# EAGLE design thermoshield (EAGLE 7.6.0)
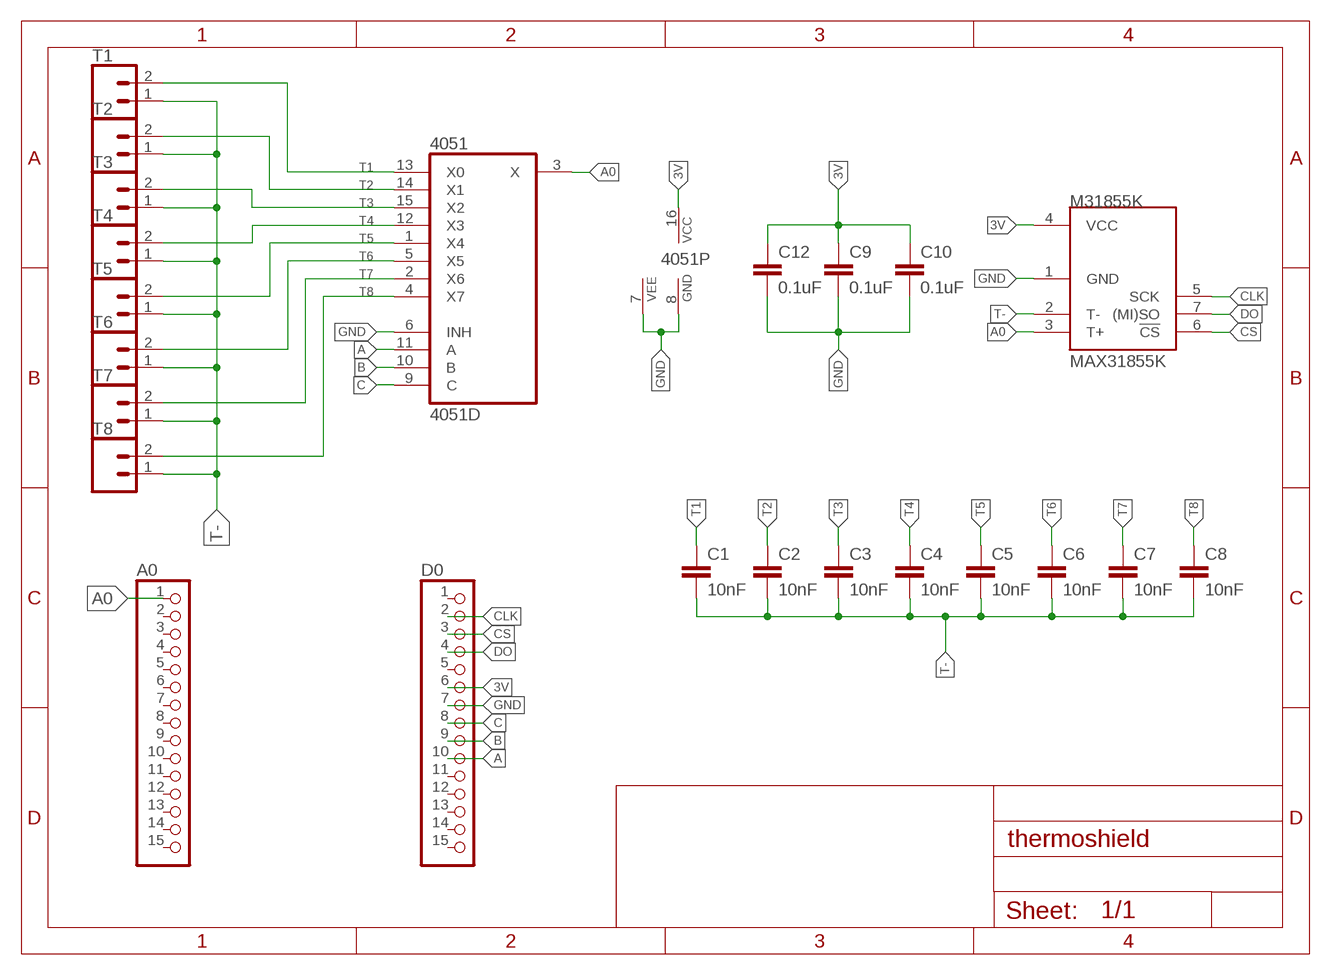
[diagram p0: schematic, sheet 1]

## Parts
4051  4051D  [SO16]
A0  PINHD-1X15  [1X15]
C1  10nF  10NF-0603-50V-10%  [0603]
C2  10nF  10NF-0603-50V-10%  [0603]
C3  10nF  10NF-0603-50V-10%  [0603]
C4  10nF  10NF-0603-50V-10%  [0603]
C5  10nF  10NF-0603-50V-10%  [0603]
C6  10nF  10NF-0603-50V-10%  [0603]
C7  10nF  10NF-0603-50V-10%  [0603]
C8  10nF  10NF-0603-50V-10%  [0603]
C9  0.1uF  0.1UF-0603-25V-(+80/-20%)  [0603]
C10  0.1uF  0.1UF-0603-25V-(+80/-20%)  [0603]
C12  0.1uF  0.1UF-0603-25V-(+80/-20%)  [0603]
D0  PINHD-1X15  [1X15]
M31855K  MAX31855K  [SO08]
T1  CONN_023.5MM-NO_SILK  [SCREWTERMINAL-3.5MM-2-NS]
T2  CONN_023.5MM-NO_SILK  [SCREWTERMINAL-3.5MM-2-NS]
T3  CONN_023.5MM-NO_SILK  [SCREWTERMINAL-3.5MM-2-NS]
T4  CONN_023.5MM-NO_SILK  [SCREWTERMINAL-3.5MM-2-NS]
T5  CONN_023.5MM-NO_SILK  [SCREWTERMINAL-3.5MM-2-NS]
T6  CONN_023.5MM-NO_SILK  [SCREWTERMINAL-3.5MM-2-NS]
T7  CONN_023.5MM-NO_SILK  [SCREWTERMINAL-3.5MM-2-NS]
T8  CONN_023.5MM-NO_SILK  [SCREWTERMINAL-3.5MM-2-NS]

## Nets
3V: 4051.16(VCC) C9.1 C10.1 C12.1 D0.6 M31855K.4(VCC)
A: 4051.11(A) D0.10
A0: 4051.3(X) A0.1 M31855K.3(T+)
B: 4051.10(B) D0.9
C: 4051.9(C) D0.8
CLK: D0.2 M31855K.5(SCK)
CS: D0.3 M31855K.6(!CS)
DO: D0.4 M31855K.7((MI)SO)
GND: 4051.6(INH) 4051.7(VEE) 4051.8(GND) C9.2 C10.2 C12.2 D0.7 M31855K.1(GND)
T1: 4051.13(X0) C1.1 T1.2
T2: 4051.14(X1) C2.1 T2.2
T3: 4051.15(X2) C3.1 T3.2
T4: 4051.12(X3) C4.1 T4.2
T5: 4051.1(X4) C5.1 T5.2
T6: 4051.5(X5) C6.1 T6.2
T7: 4051.2(X6) C7.1 T7.2
T8: 4051.4(X7) C8.1 T8.2
T-: C1.2 C2.2 C3.2 C4.2 C5.2 C6.2 C7.2 C8.2 M31855K.2(T-) T1.1 T2.1 T3.1 T4.1 T5.1 T6.1 T7.1 T8.1
Unconnected: A0.2 A0.3 A0.4 A0.5 A0.6 A0.7 A0.8 A0.9 A0.10 A0.11 A0.12 A0.13 A0.14 A0.15 D0.1 D0.5 D0.11 D0.12 D0.13 D0.14 D0.15

## Library data of the parts
4051 = 40xx:4051: 8-channel ANALOG MULTIPLEXER; SPICEPREFIX: X
A0 D0 = adafruit:PINHD-1X15: PIN HEADER
C1-C8 = SparkFun-Capacitors:10NF: 0.01uF/10nF/10,000pF ceramic capacitors A capacitor is a passive two-terminal electrical component used to store electrical energy temporarily in an electric field. CAP-09321; PROD_ID: CAP-00867
C9 C10 C12 = SparkFun-Capacitors:0.1UF: 0.1µF ceramic capacitors A capacitor is a passive two-terminal electrical component used to store electrical energy temporarily in an electric field.; PROD_ID: CAP-00810
M31855K = SparkFun-IC-Conversion:MAX31855K: Cold-Junction-Compensated K-Thermocoupleto-Digital Converter (-270°C to +1800°C) The MAX31855K performs cold-junction compensation and digitizes the signal from a type-K thermocouple. The data is output in a 14-bit resolution, SPI™-compatible, read-only format. This converter resolves temperatures to 0.25°C, allows readings as high as +1800°C and as low as -270°C, and exhibits thermocouple accuracy of ±2°C for temperatures ranging from -200°C to +700°C for K-type thermocouples. Datasheet <https://cdn.sparkfun.com/datasheets/Sensors/Temp/MAX31855K.pdf> SparkFun Products SparkFun Thermocouple Breakout - MAX31855K <https://www.sparkfun.com/products/13266> (SEN-13266); PROD_ID: IC-12578
T1-T8 = SparkFun-Connectors:CONN_02: Multi connection point. Often used as Generic Header-pin footprint for 0.1 inch spaced/style header connections On any of the 0.1 inch spaced packages, you can populate with these: Break Away Headers - Straight <https://www.sparkfun.com/products/116> (PRT-00116) Break Away Male Headers - Right Angle <https://www.sparkfun.com/products/553> (PRT-00553) Female Headers <https://www.sparkfun.com/products/115> (PRT-00115) Break Away Headers - Machine Pin <https://www.sparkfun.com/products/117> (PRT-00117) Break Away Female Headers - Swiss Machine Pin <https://www.sparkfun.com/products/743> (PRT-00743) For SCREWTERMINALS and SPRING TERMINALS visit here: Screw Terimnals on SparkFun.com <https://www.sparkfun.com/search/results?term=Screw+Terminals> (5mm/3.5mm/2.54mm spacing) This device is also useful as a general connection point to wire up your design to another part of your project. Our various solder wires solder well into these plated through hole pads. Hook-Up Wire - Assortment (Stranded, 22 AWG) <https://www.sparkfun.com/products/11375> (PRT-11375) Hook-Up Wire - Assortment (Solid Core, 22 AWG) <https://www.sparkfun.com/products/11367> (PRT-11367) View the entire wire category on our website here <https://www.sparkfun.com/categories/141> Special notes: Molex polarized connector foot print use with: PRT-08233 with associated crimp pins and housings. 2.54_SCREWTERM for use with PRT-10571. 3.5mm Screw Terminal footprints for PRT-08084 5mm Screw Terminal footprints for use with PRT-08432; PROD_ID: CONN-08399

## Board
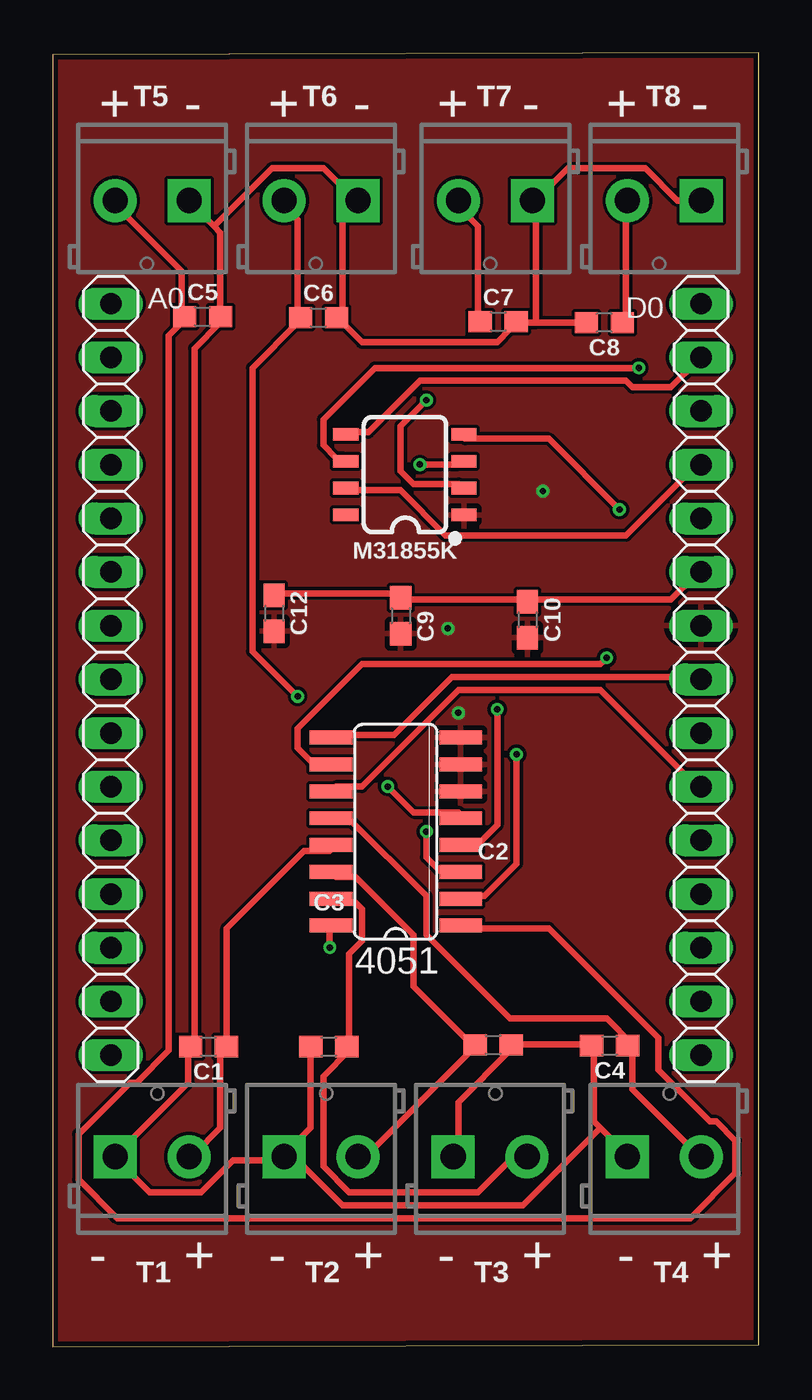
[diagram p1: board, top side]
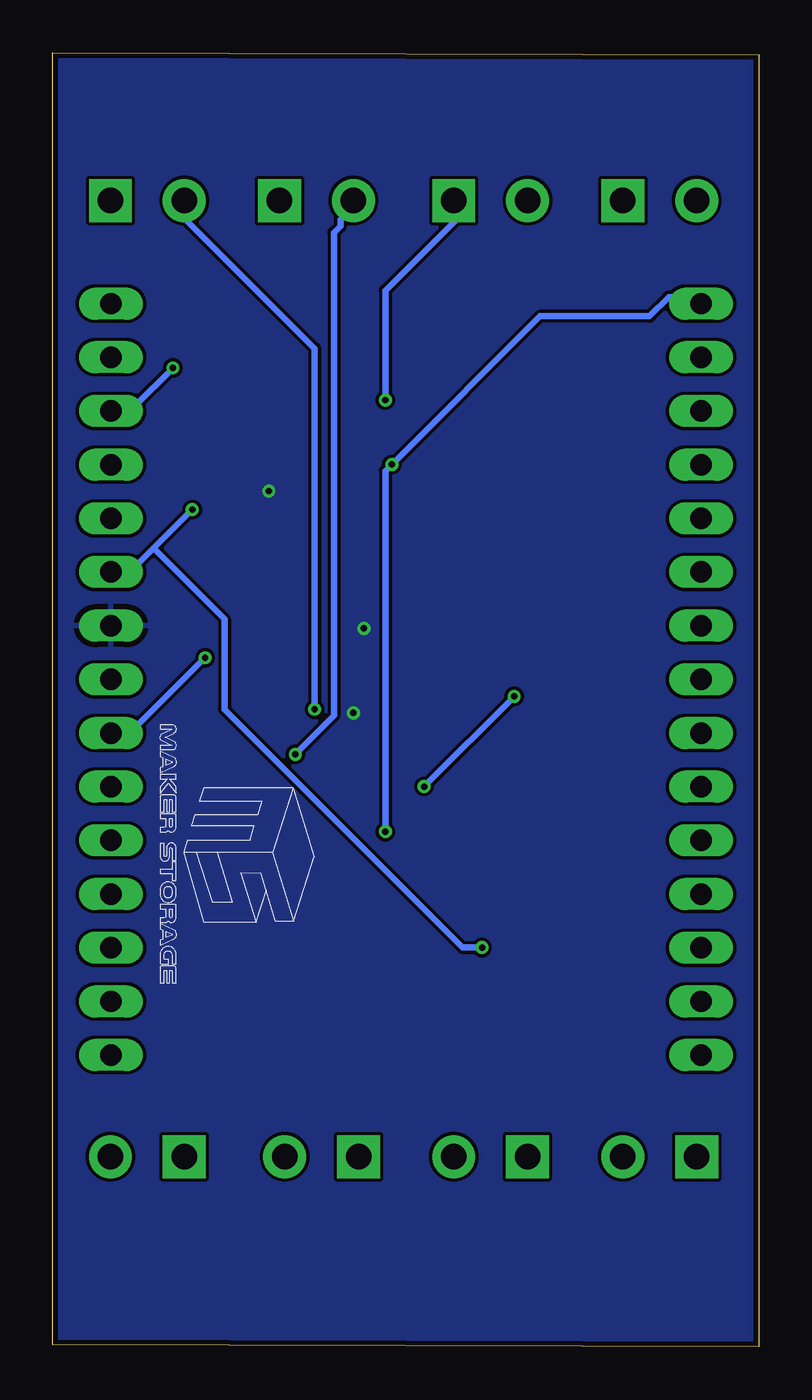
[diagram p2: board, bottom side, seen from below]

Size 33.43 x 61.23 mm. Coordinates in mm from the lower left corner, seen from the top.
Outline: 0,0 33.43,0.1 33.43,61.23 0,61.13 0,0
Copper layers (1*16): Top 0.035mm / dielectric 1.5mm / Bottom 0.035mm
Design rules "SeeedStudio_2layer_DRU_no_angle_20140221": minimum track width 6mil, minimum drill 12mil, track to track 6mil, track to pad 6mil, pad to pad 6mil, via to via 6mil, smd to smd 0mil, copper to edge 10mil, drill to drill 10mil, minimum pad ring 10mil, minimum via ring 6mil, stop-mask expansion 2mil, vias tented up to drill 100mil, thermal gap 10mil

### Footprints (pad centres in the part's own frame; a part is rotated, then mirrored left to right if it is on the bottom)
SO16 = smd 0.66 x 2.032: 1 -4.445,-3.073; 2 -3.175,-3.073; 3 -1.905,-3.073; 4 -0.635,-3.073; 5 0.635,-3.073; 6 1.905,-3.073; 7 3.175,-3.073; 8 4.445,-3.073; 9 4.445,3.073; 10 3.175,3.073; 11 1.905,3.073; 12 0.635,3.073; 13 -0.635,3.073; 14 -1.905,3.073; 15 -3.175,3.073; 16 -4.445,3.073
1X15 = drill 1.016 long: 1 -17.78,0; 2 -15.24,0; 3 -12.7,0; 4 -10.16,0; 5 -7.62,0; 6 -5.08,0; 7 -2.54,0; 8 0,0; 9 2.54,0; 10 5.08,0; 11 7.62,0; 12 10.16,0; 13 12.7,0; 14 15.24,0; 15 17.78,0
0603 = smd 1.1 x 1: 1 -0.85,0; 2 0.85,0
SO08 = smd 0.6 x 1.2: 1 -1.905,-2.8; 2 -0.635,-2.8; 3 0.635,-2.8; 4 1.905,-2.8; 5 1.905,2.8; 6 0.635,2.8; 7 -0.635,2.8; 8 -1.905,2.8
SCREWTERMINAL-3.5MM-2-NS = drill 1.2 pad 2.032 square: 1 0,0 | drill 1.2 pad 2.032: 2 3.5,0

### Placement (x,y rotation side)
4051  16.23,24.37 90 top
A0  2.74,31.58 270 top
C1  7.37,14.2 180 top
C2  20.84,14.28 0 top
C3  13.06,14.2 180 top
C4  26.36,14.25 180 top
C5  7.09,48.74 0 top
C6  12.58,48.7 0 top
C7  21.09,48.5 0 top
C8  26.11,48.47 180 top
C9  16.47,34.59 270 top
C10  22.47,34.4 270 top
C12  10.47,34.71 270 top
D0  30.68,31.58 270 top
M31855K  16.66,41.27 90 top
T1  2.95,8.99 0 top
T2  10.95,8.99 0 top
T3  18.95,8.99 0 top
T4  27.2,8.99 0 top
T5  6.45,54.24 180 top
T6  14.45,54.24 180 top
T7  22.7,54.24 180 top
T8  30.7,54.24 180 top

### Tracks (layer width: path | path; a pad name or v marks a point on that pad's centre or on a via)
3V  (via drill 0.3)
  Top 0.305: C12.1 10.67,35.65 16.46,35.65 C9.1 16.77,35.35 22.25,35.35 C10.1 22.56,35.35 29.27,35.35 30.48,36.57 D0.6 | v26.83,39.61 23.47,42.97 19.51,42.97 M31855K.4 | v13.11,18.89 13.11,19.8 4051.16
  Bottom 0.305: 28.66,37.79 29.57,36.87 30.48,36.87 D0.6 | 28.66,37.79 v26.83,39.61 | v13.11,18.89 14.03,18.89 25.3,30.16 25.3,34.43 28.66,37.79
A
  Top 0.305: 4051.11 13.42,26.51 14.63,26.51 19.21,31.08 25.91,31.08 30.48,26.51 D0.10
A0  (via drill 0.3)
  Top 0.305: v17.38,41.75 19.21,41.75 M31855K.3 | v17.68,24.37 17.68,23.15 18.29,22.54 19.21,22.54 4051.3
  Bottom 0.305: A0.1 3.05,49.67 4.27,49.67 5.19,48.76 10.37,48.76 v17.38,41.75 17.68,41.44 v17.68,24.37
B  (via drill 0.3)
  Top 0.305: v26.22,32.6 25.91,32.3 14.63,32.3 11.59,29.25 11.59,28.34 12.2,27.73 13.11,27.73 4051.10
  Bottom 0.305: v26.22,32.6 29.57,29.25 30.48,29.25 D0.9
C
  Top 0.305: 4051.9 13.42,28.95 16.16,28.95 18.9,31.69 30.48,31.69 D0.8
CLK
  Top 0.305: M31855K.5 14.03,43.27 14.94,43.27 17.38,45.71 27.13,45.71 27.44,45.41 29.27,45.41 30.48,46.62 D0.2
CS  (via drill 0.3)
  Top 0.305: v27.74,46.32 15.24,46.32 12.81,43.88 12.81,42.66 13.42,42.05 13.72,42.05 M31855K.6
  Bottom 0.305: v27.74,46.32 29.57,44.49 30.48,44.49 D0.3
DO
  Top 0.305: M31855K.7 14.03,40.53 16.46,40.53 18.6,38.4 27.13,38.4 30.48,41.75 D0.4
GND  (via drill 0.3)
  other vias: 23.2,40.49 18.7,33.99 19.2,29.99
  pour Top: -2.8,60.99 -2.8,0.24 33.3,0.24 38.3,64.99
  pour Bottom: -2.3,60.99 -2.3,0.24 33.3,0.24 41.3,68.99
T1
  Top 0.305: T1.2 6.71,9.13 7.93,10.35 7.93,14.01 C1.1 8.23,14.32 8.23,19.8 11.89,23.46 13.11,23.46 4051.13
T2
  Top 0.305: T2.2 14.63,8.83 19.82,14.01 C2.1 19.82,14.32 17.07,17.06 17.07,19.5 14.33,22.24 13.42,22.24 4051.14
T3
  Top 0.305: 4051.15 13.42,21.02 14.33,21.02 14.63,20.72 14.63,19.19 14.03,18.58 14.03,14.32 C3.1 14.03,14.01 12.81,12.79 12.81,8.52 14.03,7.31 20.12,7.31 21.65,8.83 22.25,8.83 T3.2
T4
  Top 0.305: T4.2 30.48,9.13 27.44,12.18 27.44,14.01 C4.1 27.44,14.32 26.22,15.54 21.65,15.54 17.68,19.5 17.68,21.33 14.03,24.98 13.42,24.98 4051.12
T5
  Top 0.305: T5.2 3.05,53.94 6.1,50.89 6.1,48.76 C5.1 6.1,48.45 5.49,47.84 5.49,14.01 3.97,12.49 3.66,12.49 1.22,10.05 1.22,7.92 3.05,6.09 30.18,6.09 32.31,8.22 32.31,9.74 31.4,10.66 31.09,10.66 28.66,13.1 28.66,14.62 23.47,19.8 19.51,19.8 4051.1
T6  (via drill 0.3)
  Top 0.305: T6.2 10.98,53.94 11.59,53.33 11.59,48.76 C6.1 11.59,48.45 9.45,46.32 9.45,32.91 v11.59,30.77 | v15.85,26.51 17.07,25.29 19.21,25.29 4051.5
  Bottom 0.305: v11.59,30.77 v15.85,26.51
T7  (via drill 0.3)
  Top 0.305: C7.1 20.12,48.76 20.12,53.02 19.21,53.94 T7.2 | v21.95,28.03 21.95,22.85 20.43,21.33 19.51,21.33 4051.2
  Bottom 0.305: v21.95,28.03 20.12,29.86 20.12,52.72 19.82,53.02 19.82,53.33 19.21,53.94 T7.2
T8  (via drill 0.3)
  Top 0.305: C8.1 27.13,48.76 27.13,53.94 T8.2 | v21.04,30.16 21.04,24.68 20.12,23.76 19.51,23.76 4051.4
  Bottom 0.305: v21.04,30.16 21.04,47.23 27.13,53.33 27.13,53.94 T8.2
T-  (via drill 0.3)
  Top 0.305: C3.2 12.2,14.01 12.2,10.35 10.98,9.13 T2.1 | T2.1 10.67,8.83 8.54,8.83 7.02,7.31 4.58,7.31 3.05,8.83 T1.1 3.05,9.13 6.41,12.49 6.41,14.01 C1.2 6.71,14.32 6.71,47.23 7.93,48.45 C5.2 7.93,48.76 7.93,52.72 7.62,53.02 | 25.91,10.35 27.13,9.13 T4.1 | 25.91,10.35 25.61,10.66 25.61,14.01 C4.2 25.3,14.32 21.95,14.32 C2.2 21.65,14.01 19.21,11.57 19.21,9.13 T3.1 | 25.91,10.35 22.25,6.7 13.72,6.7 11.59,8.83 10.98,8.83 T2.1 | 22.86,48.45 25,48.45 C8.2 | 22.86,48.45 21.95,48.45 C7.2 21.65,48.45 21.65,48.15 21.04,47.54 14.63,47.54 13.72,48.45 C6.2 13.72,48.76 13.72,53.33 14.33,53.94 T6.1 14.33,54.24 12.81,55.77 10.37,55.77 7.62,53.02 | 22.86,48.45 22.86,53.94 T7.1 22.86,54.24 24.39,55.77 28.05,55.77 29.57,54.24 30.48,54.24 T8.1 | 7.62,53.02 6.71,53.94 T5.1 | v17.68,44.8 16.46,43.58 16.46,41.44 17.07,40.83 19.21,40.83 M31855K.2
  Bottom 0.305: v17.68,44.8 17.68,49.98 14.33,53.33 14.33,53.94 T6.1

### Text on the board
tNames: + | - | + | - | + | - | + | - | - | + | - | + | - | + | - | +